# Altium schematic sheet Index.SchDoc
size A4; SheetNumber: 1; SheetTotal: 9
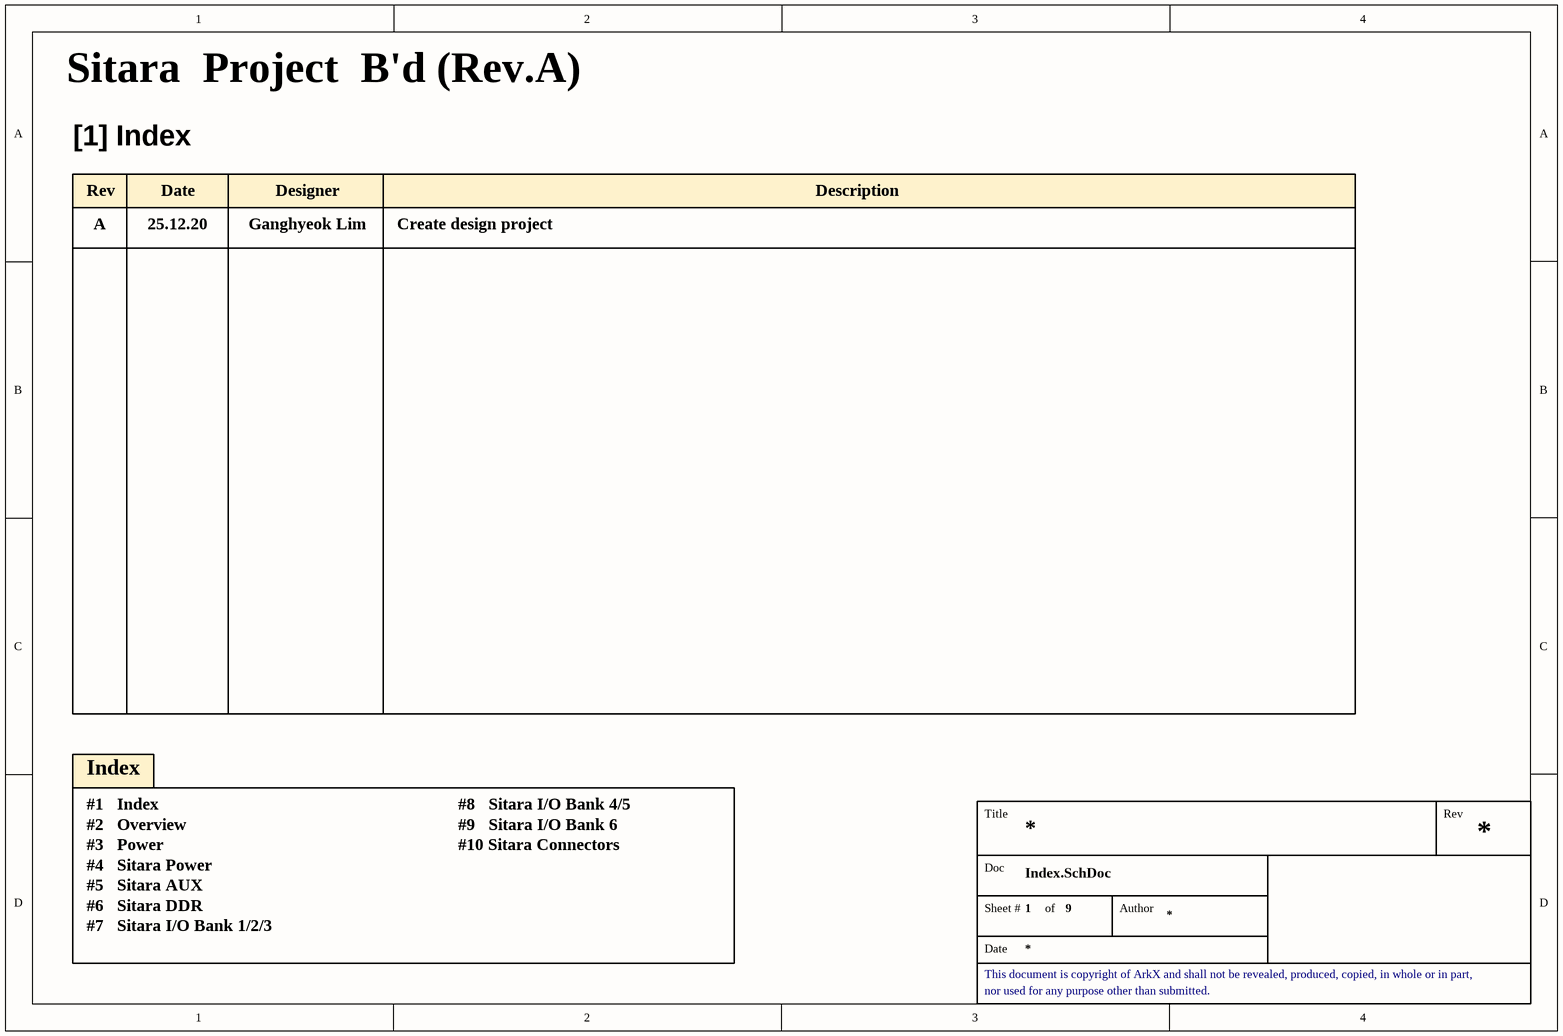
[diagram p0: Index.SchDoc]

## Notes on the sheet
- Sitara  Project  B'd (Rev.A)
- [1] Index
- Rev
- A
- 25.12.20
- Date
- Ganghyeok Lim
- Designer
- Create design project
- Description
- Index
- #1   Index
- #2   Overview
- #3   Power
- #8   Sitara I/O Bank 4/5
- #9   Sitara I/O Bank 6
- #10 Sitara Connectors
- #4   Sitara Power
- #5   Sitara AUX
- #6   Sitara DDR
- #7   Sitara I/O Bank 1/2/3
- Title
- Doc
- Sheet #
- of
- Author
- This document is copyright of ArkX and shall not be revealed, produced, copied, in whole or in part,
- nor used for any purpose other than submitted.